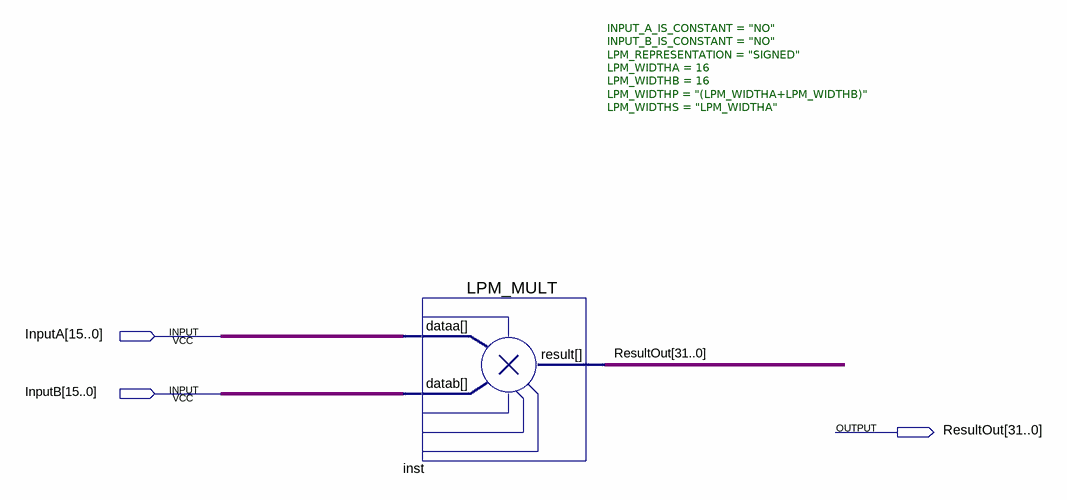
[diagram p0: schematic sheet]
// Quartus schematic TwoInputSigned16Mult.bdf as structural Verilog: 1 symbols, 3 pins
module TwoInputSigned16Mult (
  input  [15:0] InputA,
  input  [15:0] InputB,
  output [31:0] ResultOut
);

  LPM_MULT #(.INPUT_A_IS_CONSTANT("NO"), .INPUT_B_IS_CONSTANT("NO"), .LPM_REPRESENTATION("SIGNED"), .LPM_WIDTHA(16), .LPM_WIDTHB(16), .LPM_WIDTHP("(LPM_WIDTHA+LPM_WIDTHB)"), .LPM_WIDTHS("LPM_WIDTHA")) inst (
    .dataa(InputA), .datab(InputB), .result(ResultOut));
endmodule
